# EAGLE design EXT_DIMMER (EAGLE 6.5.0)
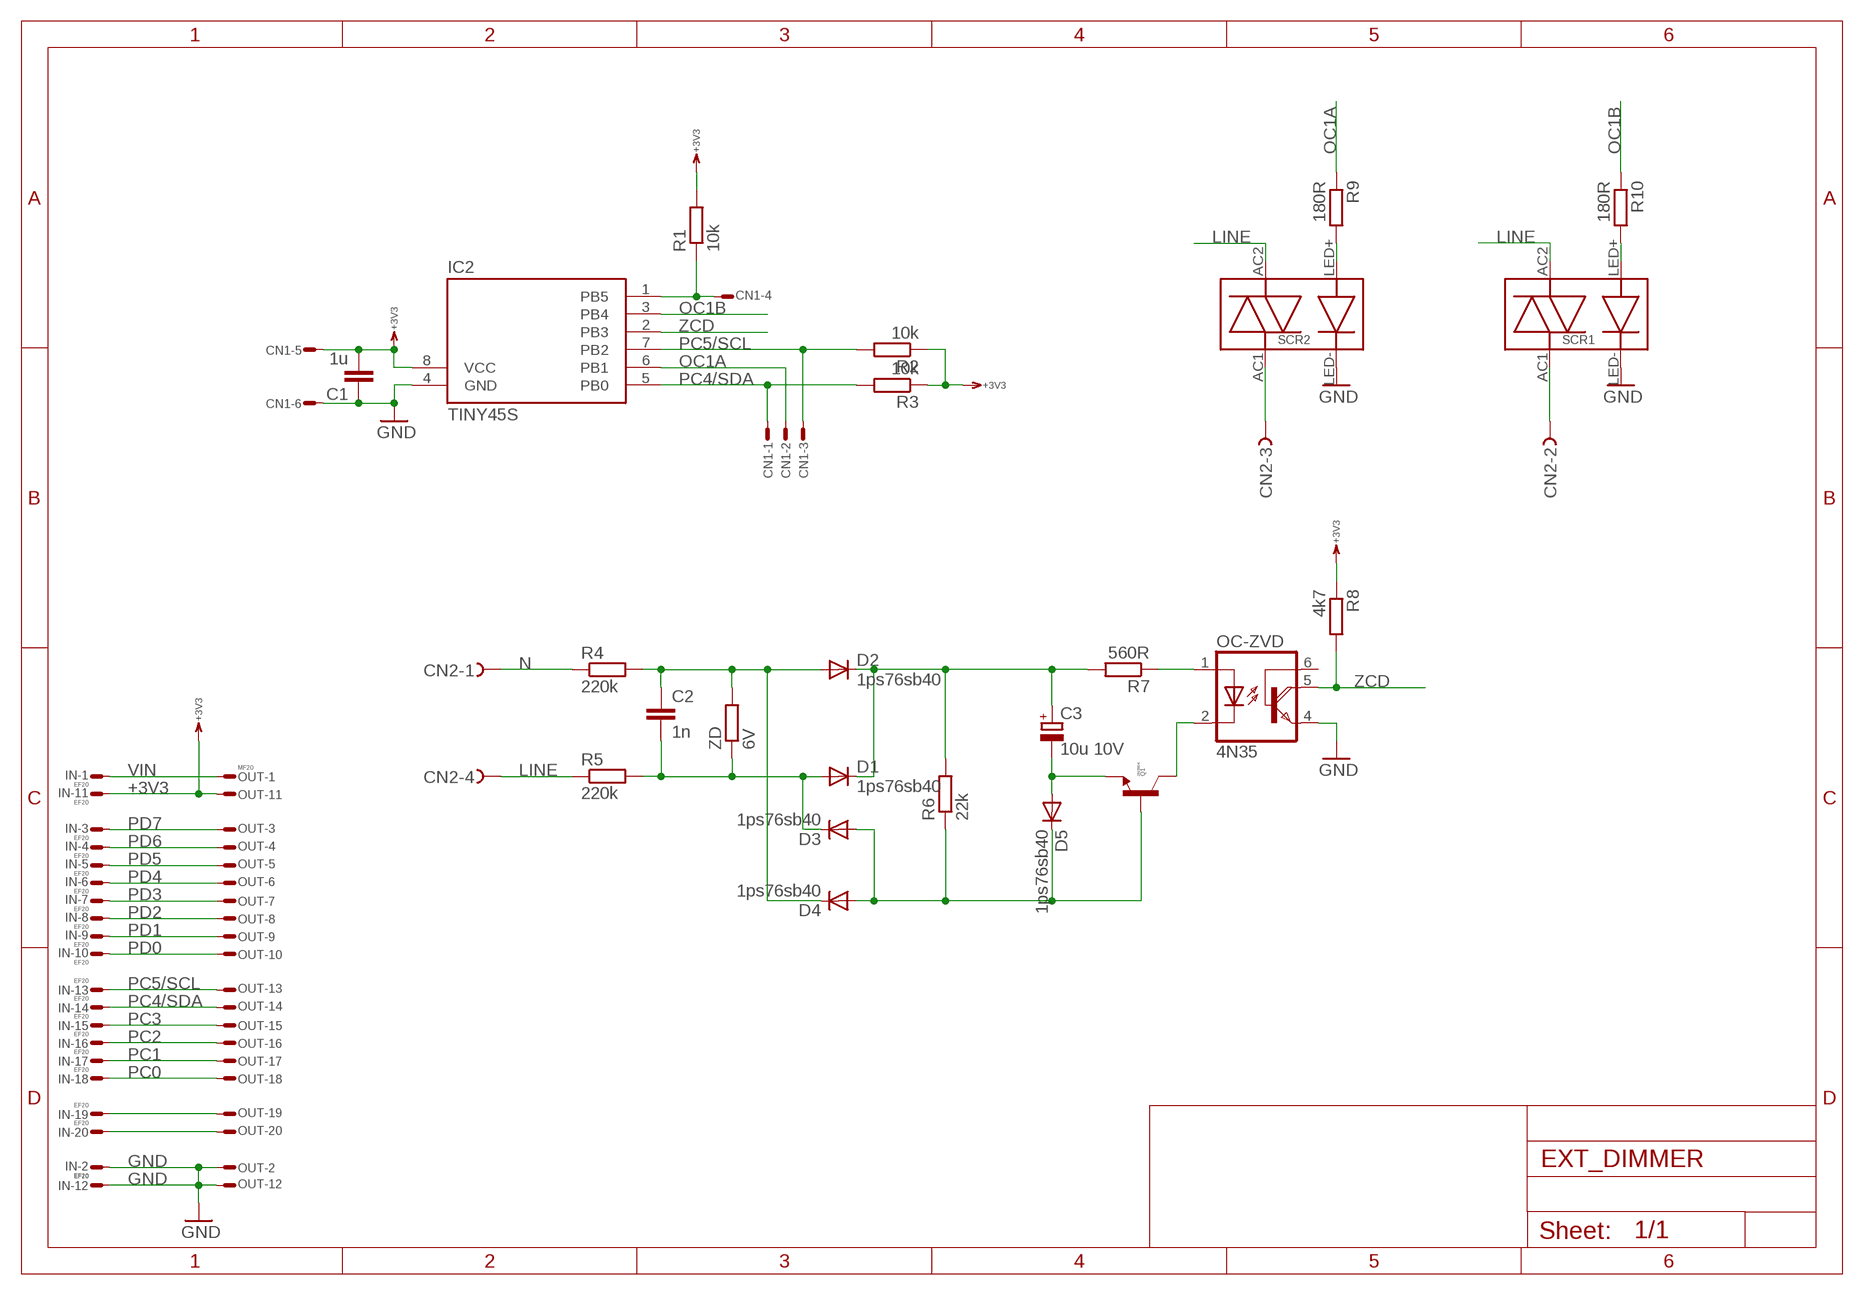
[diagram p0: schematic, sheet 1]

## Parts
C1  1u  C0603  [0603]
C2  1n  C1206  [1206]
C3  10u 10V  C_POLSMCA  [SMC_A]
CN1  CON6N  [CON6]
CN2  CON4-S  [CTB9308]
D1  1ps76sb40  DSOD323  [SOD323]
D2  1ps76sb40  DSOD323  [SOD323]
D3  1ps76sb40  DSOD323  [SOD323]
D4  1ps76sb40  DSOD323  [SOD323]
D5  1ps76sb40  DSOD323  [SOD323]
IC2  TINY45S  [SOIC8]
IN  EF20  FE20ELSS  [FE10-2WSS]
OC-ZVD  4N35  OC-NPN  [DIL06]
OUT  MF20  ML20LSE  [ML20LS]
Q1  2N3904  NPN23  [SOT23]
R1  10k  R0603  [0603]
R2  10k  R0603  [0603]
R3  10k  R0603  [0603]
R4  220k  R1206  [1206]
R5  220k  R1206  [1206]
R6  22k  R0603  [0603]
R7  560R  R0603  [0603]
R8  4k7  R0603  [0603]
R9  180R  R0603  [0603]
R10  180R  R0603  [0603]
SCR1  S202  [S202]
SCR2  S202  [S202]
ZD  6V  R1206  [1206]

## Nets
+3V3: C1.2 CN1.5 IC2.8(VCC) IN.P$11 OUT.P$11 R1.2 R2.1 R3.1 R8.1
GND: C1.1 CN1.6 IC2.4(GND) IN.P$2 IN.P$12 OC-ZVD.4(E) OUT.P$2 OUT.P$12 SCR1.LED-(L-) SCR2.LED-(L-)
LINE: CN2.-4 R5.1 SCR1.AC2 SCR2.AC2
N: CN2.-1 R4.1
N$1: IN.P$20 OUT.P$20
N$2: CN1.4 IC2.1(PB5) R1.1
N$3: IN.P$19 OUT.P$19
N$4: C2.1 D2.A D4.C R4.2 ZD.2
N$5: C2.2 D1.A D3.C R5.2 ZD.1
N$6: C3.+ D1.C D2.C R6.2 R7.2
N$7: D3.A D4.A D5.C Q1.1(B) R6.1
N$8: OC-ZVD.1(A) R7.1
N$9: C3.- D5.A Q1.2(E)
N$10: OC-ZVD.2(C) Q1.3(C)
N$11: R9.2 SCR2.LED+(L+)
N$12: R10.2 SCR1.LED+(L+)
N$13: CN2.-3 SCR2.AC1
N$14: CN2.-2 SCR1.AC1
OC1A: CN1.2 IC2.6(PB1) R9.1
OC1B: IC2.3(PB4) R10.1
PC0: IN.P$18 OUT.P$18
PC1: IN.P$17 OUT.P$17
PC2: IN.P$16 OUT.P$16
PC3: IN.P$15 OUT.P$15
PC4/SDA: CN1.1 IC2.5(PB0) IN.P$14 OUT.P$14 R3.2
PC5/SCL: CN1.3 IC2.7(PB2) IN.P$13 OUT.P$13 R2.2
PD0: IN.P$10 OUT.P$10
PD1: IN.P$9 OUT.P$9
PD2: IN.P$8 OUT.P$8
PD3: IN.P$7 OUT.P$7
PD4: IN.P$6 OUT.P$6
PD5: IN.P$5 OUT.P$5
PD6: IN.P$4 OUT.P$4
PD7: IN.P$3 OUT.P$3
VIN: IN.P$1 OUT.P$1
ZCD: IC2.2(PB3) OC-ZVD.5(COL) R8.2
Unconnected: OC-ZVD.6(B)

## Library data of the parts
C1 C2 = RCL:C: Capacitor SMD
C3 = RCL:C_POL: POLARIZED CAPACITOR, European symbol
CN1 = Conn:CON6
CN2 = Conn:CON4-S
D1-D5 = Diode:D: Diode
IC2 = atmel:TINY45: MICROCONTROLLER 2.7 V 1 Kbytes FLASH 64 bytes EEPROM 4-channel 10 bit ADC
IN = Conn:FE20E
OC-ZVD = Optic:OC-NPN: OPTO COUPLER; MF: VISHAY/TELEFUNKEN; MPN: 4N33; OC_FARNELL: 1469601; OC_NEWARK: 88K1390
OUT = Conn:ML20?E: HARTING
Q1 = Transistor:NPN
R1-R10 ZD = RCL:R: Resistor SMD
SCR1 SCR2 = Relay_Switch:S202

## Board
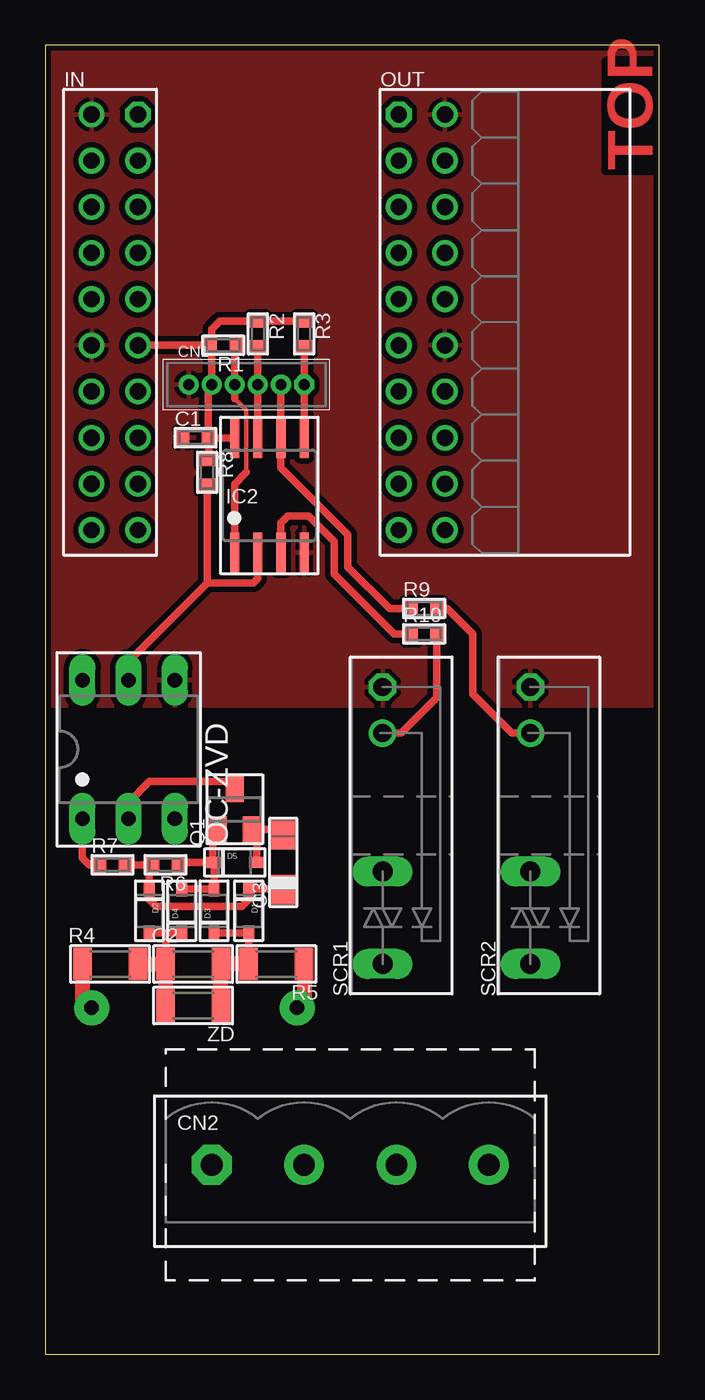
[diagram p1: board, top side]
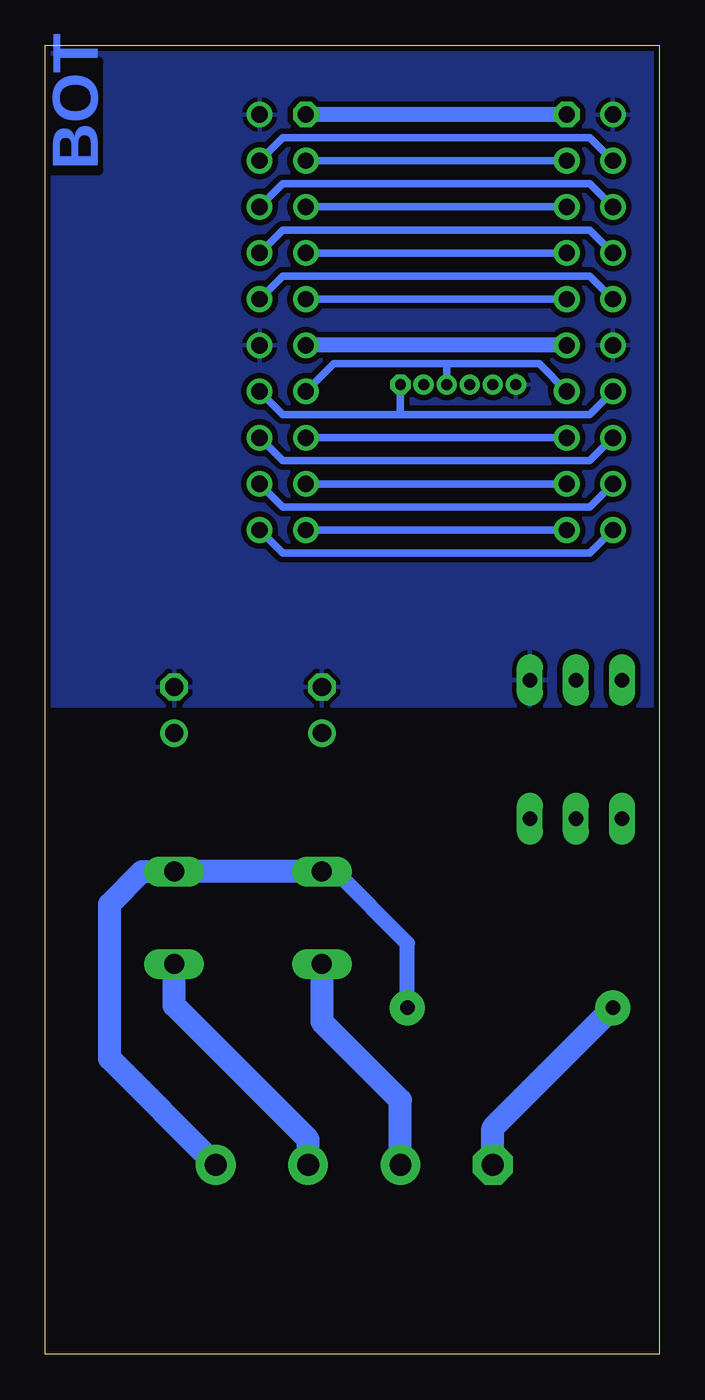
[diagram p2: board, bottom side, seen from below]

Size 33.75 x 72 mm. Coordinates in mm from the lower left corner, seen from the top.
Outline: 0,0 33.75,0 33.75,72 0,72 0,0
Copper layers (1*16): Top 0.035mm / dielectric 1.5mm / Bottom 0.035mm
Design rules "default *": minimum track width 10mil, minimum drill 10mil, track to track 12mil, track to pad 12mil, pad to pad 12mil, via to via 12mil, smd to smd 12mil, copper to edge 12mil, drill to drill 8mil, minimum pad ring 10mil, minimum via ring 8mil, stop-mask expansion 4mil, vias tented up to drill 0mil, thermal gap 10mil
tKeepout: area 0,0 to 33.8,2; area 0,70 to 33.8,72

### Footprints (pad centres in the part's own frame; a part is rotated, then mirrored left to right if it is on the bottom)
0603 = smd 0.7 x 0.9: 1 -0.697,0; 2 0.697,0
1206 = smd 1.016 x 1.778: 1 -1.524,0; 2 1.524,0
SMC_A = smd 1.6 x 1.4: + -1.5,0; - 1.5,0
CON6 = drill 0.6 pad 1.016 octagon: 1 0,3.81 | drill 0.6 pad 1.016: 2 0,2.54; 3 0,1.27; 4 0,0; 5 0,-1.27; 6 0,-2.54
CTB9308 = drill 1.2 pad 2.184 octagon: -1 -7.62,0 | drill 1.2 pad 2.184: -2 -2.54,0; -3 2.54,0; -4 7.62,0
SOD323 = smd 0.8 x 0.6: A 1.2,0; C -1.2,0
SOIC8 = smd 0.5 x 2.2: 1 -1.905,-3.154; 2 -0.635,-3.154; 3 0.635,-3.154; 4 1.905,-3.154; 5 1.905,3.154; 6 0.635,3.154; 7 -0.635,3.154; 8 -1.905,3.154
FE10-2WSS = drill 0.9 octagon: P$1 -11.43,1.27 | drill 0.9: P$2 -11.43,-1.27; P$3 -8.89,1.27; P$4 -8.89,-1.27; P$5 -6.35,1.27; P$6 -6.35,-1.27; P$7 -3.81,1.27; P$8 -3.81,-1.27; P$9 -1.27,1.27; P$10 -1.27,-1.27; P$11 1.27,1.27; P$12 1.27,-1.27; P$13 3.81,1.27; P$14 3.81,-1.27; P$15 6.35,1.27; P$16 6.35,-1.27; P$17 8.89,1.27; P$18 8.89,-1.27; P$19 11.43,1.27; P$20 11.43,-1.27
DIL06 = drill 0.8 pad 1.422 long: 1 -2.54,-3.81; 2 0,-3.81; 3 2.54,-3.81; 4 2.54,3.81; 5 0,3.81; 6 -2.54,3.81
ML20LS = drill 0.9 octagon: P$1 -11.43,-1.27 | drill 0.9: P$2 -11.43,1.27; P$3 -8.89,-1.27; P$4 -8.89,1.27; P$5 -6.35,-1.27; P$6 -6.35,1.27; P$7 -3.81,-1.27; P$8 -3.81,1.27; P$9 -1.27,-1.27; P$10 -1.27,1.27; P$11 1.27,-1.27; P$12 1.27,1.27; P$13 3.81,-1.27; P$14 3.81,1.27; P$15 6.35,-1.27; P$16 6.35,1.27; P$17 8.89,-1.27; P$18 8.89,1.27; P$19 11.43,-1.27; P$20 11.43,1.27
SOT23 = smd 1 x 1.4: 1 -0.95,-1.1; 2 0.95,-1.1; 3 0,1.1
S202 = drill 1.1 long: AC1 -7.62,0; AC2 -2.54,0 | drill 1: LED+ 5.08,0 | drill 1 octagon: LED- 7.62,0

### Placement (x,y rotation side)
C1  8.26,50.42 0 top
C2  8.13,21.46 0 top
C3  13.08,27.05 90 top
CN1  10.41,53.34 270 top
CN2  16.76,10.41 0 top
D1  11.18,24.38 270 top
D2  5.71,24.38 270 top
D3  9.27,24.38 90 top
D4  7.49,24.38 90 top
D5  10.41,27.05 0 top
IC2  12.32,47.24 0 top
IN  3.81,56.77 270 top
OC-ZVD  4.57,33.27 0 top
OUT  20.7,56.77 270 top
Q1  10.41,29.97 0 top
R1  9.78,55.5 180 top
R2  11.68,56.13 270 top
R3  14.22,56.13 270 top
R4  3.56,21.46 0 top
R5  12.7,21.46 180 top
R6  6.6,26.92 180 top
R7  3.68,26.92 0 top
R8  8.89,48.51 270 top
R9  20.83,41.02 0 top
R10  20.83,39.62 0 top
SCR1  18.54,29.08 90 top
SCR2  26.67,29.08 90 top
ZD  8.13,19.18 180 top

### Tracks (layer width: path | path; a pad name or v marks a point on that pad's centre or on a via)
+3V3
  Top 0.406: IC2.8 8.97,50.4 | 8.97,50.4 C1.2 8.95,53.15 CN1.5 9.14,55.44 | R3.1 R2.1 9.59,56.83 9.14,56.39 9.14,55.5 | 9.14,55.44 R1.2 | 9.14,55.44 9.14,55.5 | 9.14,55.5 IN.P$11 | 8.97,50.4 8.97,49.3 R8.1
  Bottom 0.813: IN.P$11 OUT.P$11
GND
  pour Bottom: 0,35.69 33.75,35.69 33.75,72 0,72
  pour Top: 0,35.69 33.75,35.69 33.75,72 0,72
LINE  (via drill 0.8 pad 1.93)
  Top 0.813: R5.1 14.22,19.43 v13.84,19.05
  Bottom 0.813: v13.84,19.05 13.84,22.61 17.78,26.54 SCR1.AC2
  Bottom 1.27: SCR1.AC2 SCR2.AC2 28.45,26.54 30.23,24.77 30.23,16.26 CN2.-4
N  (via drill 0.8 pad 1.93)
  Top 0.813: R4.1 2.03,19.56 v2.54,19.05
  Bottom 1.27: CN2.-1 9.14,12.45 v2.54,19.05
N$1
  Bottom 0.406: OUT.P$20 20.7,44.07 3.81,44.07 IN.P$20
N$2
  Top 0.254: 10.41,52.58 11.05,51.94 11.05,48.51 | 10.41,44.07 IC2.1
  Top 0.406: 10.41,52.58 CN1.4 10.41,55.44 R1.1 | 11.05,48.51 10.41,47.88 IC2.1
N$3
  Bottom 0.406: OUT.P$19 IN.P$19
N$4
  Top 0.406: D2.A 6.53,23.18 6.6,23.11 | 6.6,23.11 C2.1 | D4.C 6.67,23.18 6.6,23.11
  Top 0.813: R4.2 C2.1 ZD.2
N$5
  Top 0.406: R5.2 D1.A D3.C
  Top 0.813: R5.2 C2.2 ZD.1
N$6
  Top 0.406: C3.+ 13.05,25.58 D1.C 11.18,25.02 10.79,24.64 6.1,24.64 5.71,25.02 D2.C 5.71,26.73 R6.2 R7.2
N$7
  Top 0.406: D4.A D3.A 9.27,26.99 D5.C | D5.C 9.21,28.62 Q1.1 | R6.1 7.3,26.99 7.37,27.05 D5.C
N$8
  Top 0.406: R7.1 2.41,26.92 2.03,27.3 OC-ZVD.1
N$9
  Top 0.406: D5.A 11.61,28.62 Q1.2 12.76,28.87 C3.-
N$10
  Top 0.406: OC-ZVD.2 4.57,30.35 5.71,31.5 10.41,31.5 Q1.3
N$11
  Top 0.406: R9.2 22.1,41.02 23.5,39.62 23.5,36.32 25.65,34.16 SCR2.LED+
N$12
  Top 0.406: R10.2 21.52,36.13 19.56,34.16 SCR1.LED+
N$13
  Bottom 1.27: CN2.-3 19.3,11.81 26.67,19.18 SCR2.AC1
N$14
  Bottom 1.27: SCR1.AC1 18.54,18.29 14.22,13.97 CN2.-2
OC1A
  Top 0.406: CN1.2 IC2.6 12.95,48.77 16.64,45.09 16.64,43.31 18.92,41.02 R9.1
OC1B
  Top 0.406: R10.1 19.18,39.62 15.88,42.93 15.88,44.7 14.48,46.1 13.34,46.1 12.95,45.72 IC2.3
PC0
  Bottom 0.406: OUT.P$18 20.7,46.61 3.81,46.61 IN.P$18
PC1
  Bottom 0.406: OUT.P$17 IN.P$17
PC2
  Bottom 0.406: OUT.P$16 20.7,49.15 3.81,49.15 IN.P$16
PC3
  Bottom 0.406: OUT.P$15 IN.P$15
PC4/SDA
  Top 0.406: IC2.5 CN1.1 R3.2
  Bottom 0.406: OUT.P$14 20.7,51.69 14.22,51.69 | 14.22,51.69 3.81,51.69 IN.P$14 | 14.22,51.69 CN1.1
PC5/SCL
  Top 0.406: IC2.7 CN1.3 R2.2
  Bottom 0.406: OUT.P$13 17.91,54.48 11.68,54.48 | 11.68,54.48 CN1.3 | IN.P$13 6.6,54.48 11.68,54.48
PD0
  Bottom 0.406: IN.P$10 3.81,59.31 20.7,59.31 OUT.P$10
PD1
  Bottom 0.406: IN.P$9 OUT.P$9
PD2
  Bottom 0.406: IN.P$8 3.81,61.85 20.7,61.85 OUT.P$8
PD3
  Bottom 0.406: IN.P$7 OUT.P$7
PD4
  Bottom 0.406: IN.P$6 3.81,64.39 20.7,64.39 OUT.P$6
PD5
  Bottom 0.406: IN.P$5 OUT.P$5
PD6
  Bottom 0.406: IN.P$4 3.81,66.93 20.7,66.93 OUT.P$4
PD7
  Bottom 0.406: IN.P$3 OUT.P$3
VIN
  Bottom 0.813: IN.P$1 OUT.P$1
ZCD
  Top 0.406: R8.2 8.89,42.42 | OC-ZVD.5 4.57,38.1 8.89,42.42 | IC2.2 11.68,42.67 11.43,42.42 8.89,42.42

### Text on the board
Top: TOP
Bottom: BOT